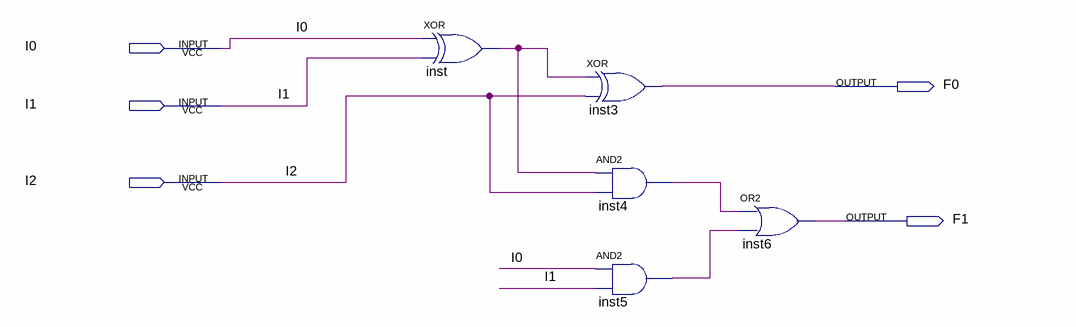
[diagram p0: schematic sheet]
// Quartus schematic ex1p4.bdf as structural Verilog: 5 symbols, 5 pins
module ex1p4 (
  input  I0,
  input  I1,
  input  I2,
  output F0,
  output F1
);

  wire inst4_out, inst5_out, inst_out;

  xor inst (inst_out, I0, I1);
  xor inst3 (F0, inst_out, I2);
  and inst4 (inst4_out, inst_out, I2);
  and inst5 (inst5_out, I0, I1);
  or inst6 (F1, inst4_out, inst5_out);
endmodule
